# EAGLE design wireless_dip (EAGLE 4.16)
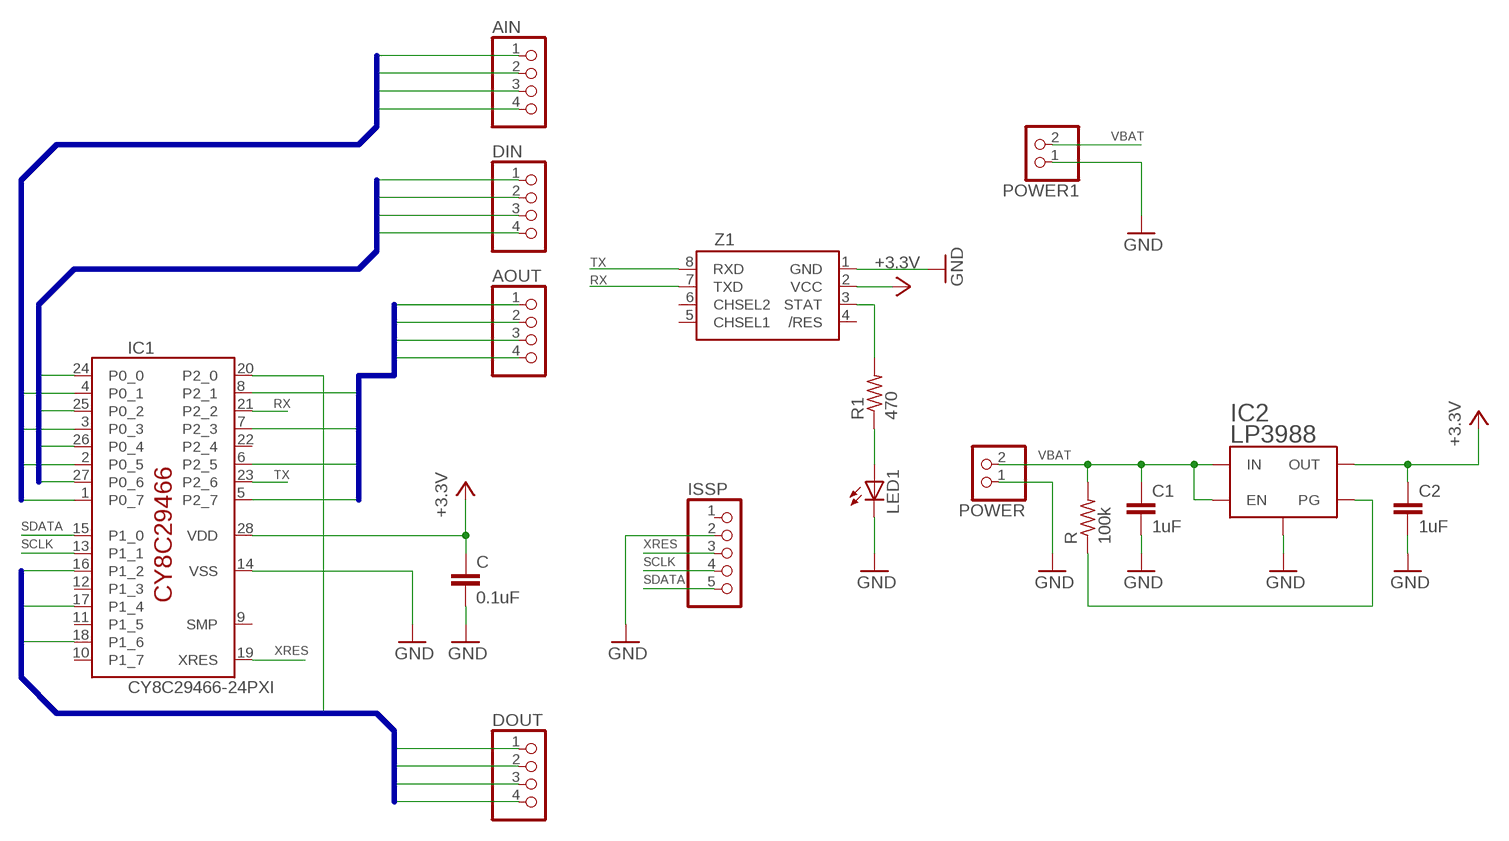
[diagram p0: schematic, sheet 1]

## Parts
AIN  PINHD-1X4  [1X04]
AOUT  PINHD-1X4  [1X04]
C  0.1uF  C-EUC1608  [C1608]
C1  1uF  C-EUC1608  [C1608]
C2  1uF  C-EUC1608  [C1608]
DIN  PINHD-1X4  [1X04]
DOUT  PINHD-1X4  [1X04]
IC1  CY8C29466-24PXI  [PDIP28]
IC2  LP3988  [SOT-23-5]
ISSP  PINHD-1X5  [1X05]
LED1  LEDCHIP-LED0603  [CHIP-LED0603]
POWER  PINHD-1X2  [1X02]
POWER1  PINHD-1X2  [1X02]
R  100k  R-US_R0603  [R0603]
R1  470  R-US_R0603  [R0603]
Z1  ZIG-100B  [ZIG-100B]

## Nets
+3V: C2.1 C.1 IC1.28(VDD) IC2.P$5(OUT) Z1.2(VCC) ; supply symbol labelled +3.3V
AIN0: AIN.1 IC1.1(P0_7)
AIN1: AIN.2 IC1.2(P0_5)
AIN2: AIN.3 IC1.3(P0_3)
AIN3: AIN.4 IC1.4(P0_1)
AOUT0: AOUT.1 IC1.5(P2_7)
AOUT1: AOUT.2 IC1.6(P2_5)
AOUT2: AOUT.3 IC1.7(P2_3)
AOUT3: AOUT.4 IC1.8(P2_1)
DIN0: DIN.1 IC1.27(P0_6)
DIN1: DIN.2 IC1.26(P0_4)
DIN2: DIN.3 IC1.25(P0_2)
DIN3: DIN.4 IC1.24(P0_0)
DOUT0: DOUT.1 IC1.20(P2_0)
DOUT1: DOUT.2 IC1.18(P1_6)
DOUT2: DOUT.3 IC1.17(P1_4)
DOUT3: DOUT.4 IC1.16(P1_2)
GND: C1.2 C2.2 C.2 IC1.14(VSS) IC2.P$2(GND) ISSP.2 LED1.C POWER1.1 POWER.1 Z1.1(GND)
N$1: R1.2 Z1.3(STAT)
N$2: LED1.A R1.1
PG: IC2.P$4(PG) R.1
RX: IC1.21(P2_2) Z1.7(TXD)
SCLK: IC1.13(P1_1) ISSP.4
SDATA: IC1.15(P1_0) ISSP.5
TX: IC1.23(P2_6) Z1.8(RXD)
VBAT: C1.1 IC2.P$1(IN) IC2.P$3(EN) POWER1.2 POWER.2 R.2
XRES: IC1.19(XRES) ISSP.3
Unconnected: IC1.9(SMP) IC1.10(P1_7) IC1.11(P1_5) IC1.12(P1_3) IC1.22(P2_4) ISSP.1 Z1.4(/RES) Z1.5(CHSEL1) Z1.6(CHSEL2)

## Buses
AIN[0..3]
AOUT[0..3]
DIN[0..3]
DOUT[0..3]

## Library data of the parts
AIN AOUT DIN DOUT = pinhead:PINHD-1X4: PIN HEADER
C C1 C2 = rcl:C-EU: CAPACITOR, European symbol
IC1 = cypress_psoc:CY8C29466-24*: PSoC Mixed-Signal Array CY8C29466-24PXI (DIP) CY8C29466-24SXI (SOIC) CY8C29466-24PVXI (SSOP)
IC2 = v-regulator_lp3988:LP3988
ISSP = pinhead:PINHD-1X5: PIN HEADER
LED1 = led:LED: LED OSRAM: - CHIPLED LG R971, LG N971, LY N971, LG Q971, LY Q971, LO R971, LY R971 LH N974, LH R974 LS Q976, LO Q976, LY Q976 LO Q996 - Hyper CHIPLED LW Q18S LB Q993, LB Q99A, LB R99A - SideLED LS A670, LO A670, LY A670, LG A670, LP A670 LB A673, LV A673, LT A673, LW A673 LH A674 LY A675 LS A676, LA A676, LO A676, LY A676, LW A676 LS A679, LY A679, LG A679 - Hyper Micro SIDELED® LS Y876, LA Y876, LO Y876, LY Y876 LT Y87S - SmartLED LW L88C, LW L88S LB L89C, LB L89S, LG L890 LS L89K, LO L89K, LY L89K LS L896, LA L896, LO L896, LY L896 - TOPLED LS T670, LO T670, LY T670, LG T670, LP T670 LSG T670, LSP T670, LSY T670, LOP T670, LYG T670 LG T671, LOG T671, LSG T671 LB T673, LV T673, LT T673, LW T673 LH T674 LS T676, LA T676, LO T676, LY T676, LB T676, LH T676, LSB T676, LW T676 LB T67C, LV T67C, LT T67C, LS T67K, LO T67K, LY T67K, LW E67C LS E67B, LA E67B, LO E67B, LY E67B, LB E67C, LV E67C, LT E67C LW T67C LS T679, LY T679, LG T679 LS T770, LO T770, LY T770, LG T770, LP T770 LB T773, LV T773, LT T773, LW T773 LH T774 LS E675, LA E675, LY E675, LS T675 LS T776, LA T776, LO T776, LY T776, LB T776 LHGB T686 LT T68C, LB T68C - Hyper Mini TOPLED® LB M676 - Mini TOPLED Santana® LG M470 LS M47K, LO M47K, LY M47K Source: http://www.osram.convergy.de - LUMILED® LXK2-PW12-R00, LXK2-PW12-S00, LXK2-PW14-U00, LXK2-PW14-V00 LXK2-PM12-R00, LXK2-PM12-S00, LXK2-PM14-U00 LXK2-PE12-Q00, LXK2-PE12-R00, LXK2-PE12-S00, LXK2-PE14-T00, LXK2-PE14-U00 LXK2-PB12-K00, LXK2-PB12-L00, LXK2-PB12-M00, LXK2-PB14-N00, LXK2-PB14-P00, LXK2-PB14-Q00 LXK2-PR12-L00, LXK2-PR12-M00, LXK2-PR14-Q00, LXK2-PR14-R00 LXK2-PD12-Q00, LXK2-PD12-R00, LXK2-PD12-S00 LXK2-PH12-R00, LXK2-PH12-S00 LXK2-PL12-P00, LXK2-PL12-Q00, LXK2-PL12-R00 Source: www.luxeon.com
POWER POWER1 = pinhead:PINHD-1X2: PIN HEADER
R R1 = rcl:R-US_: RESISTOR, American symbol
Z1 = besttechnology:ZIG-100B

## Board
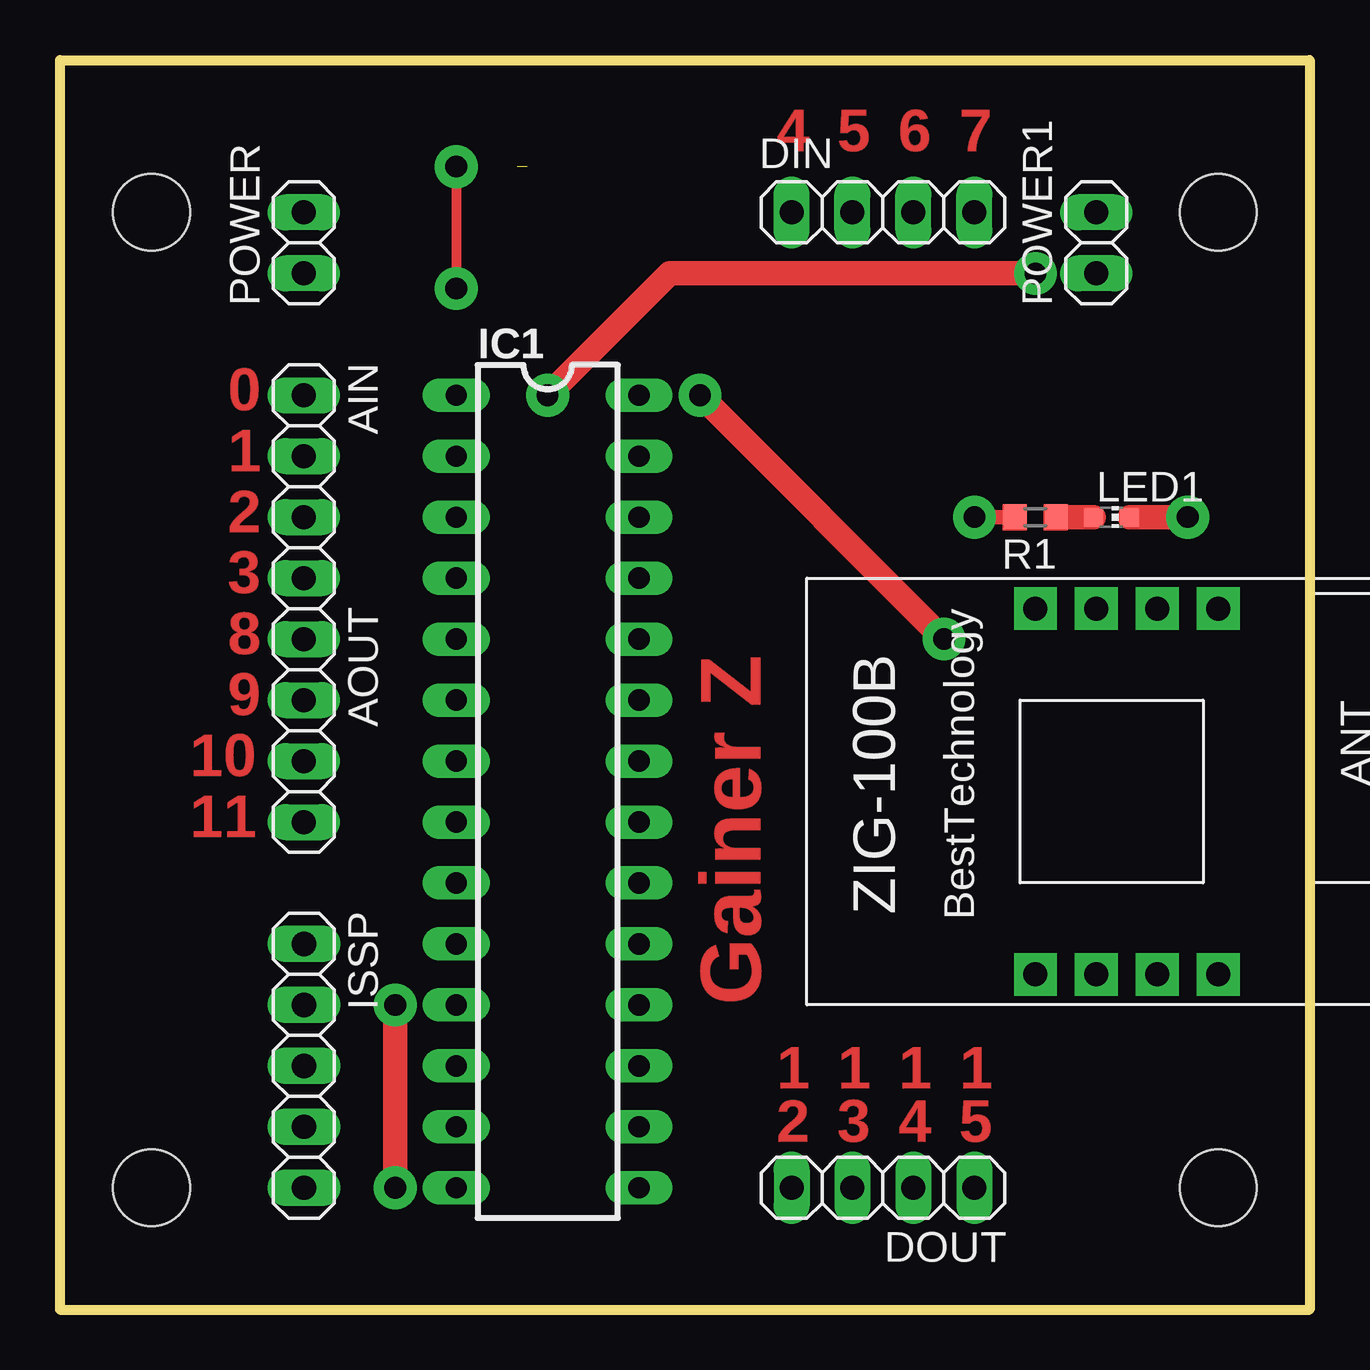
[diagram p1: board, top side]
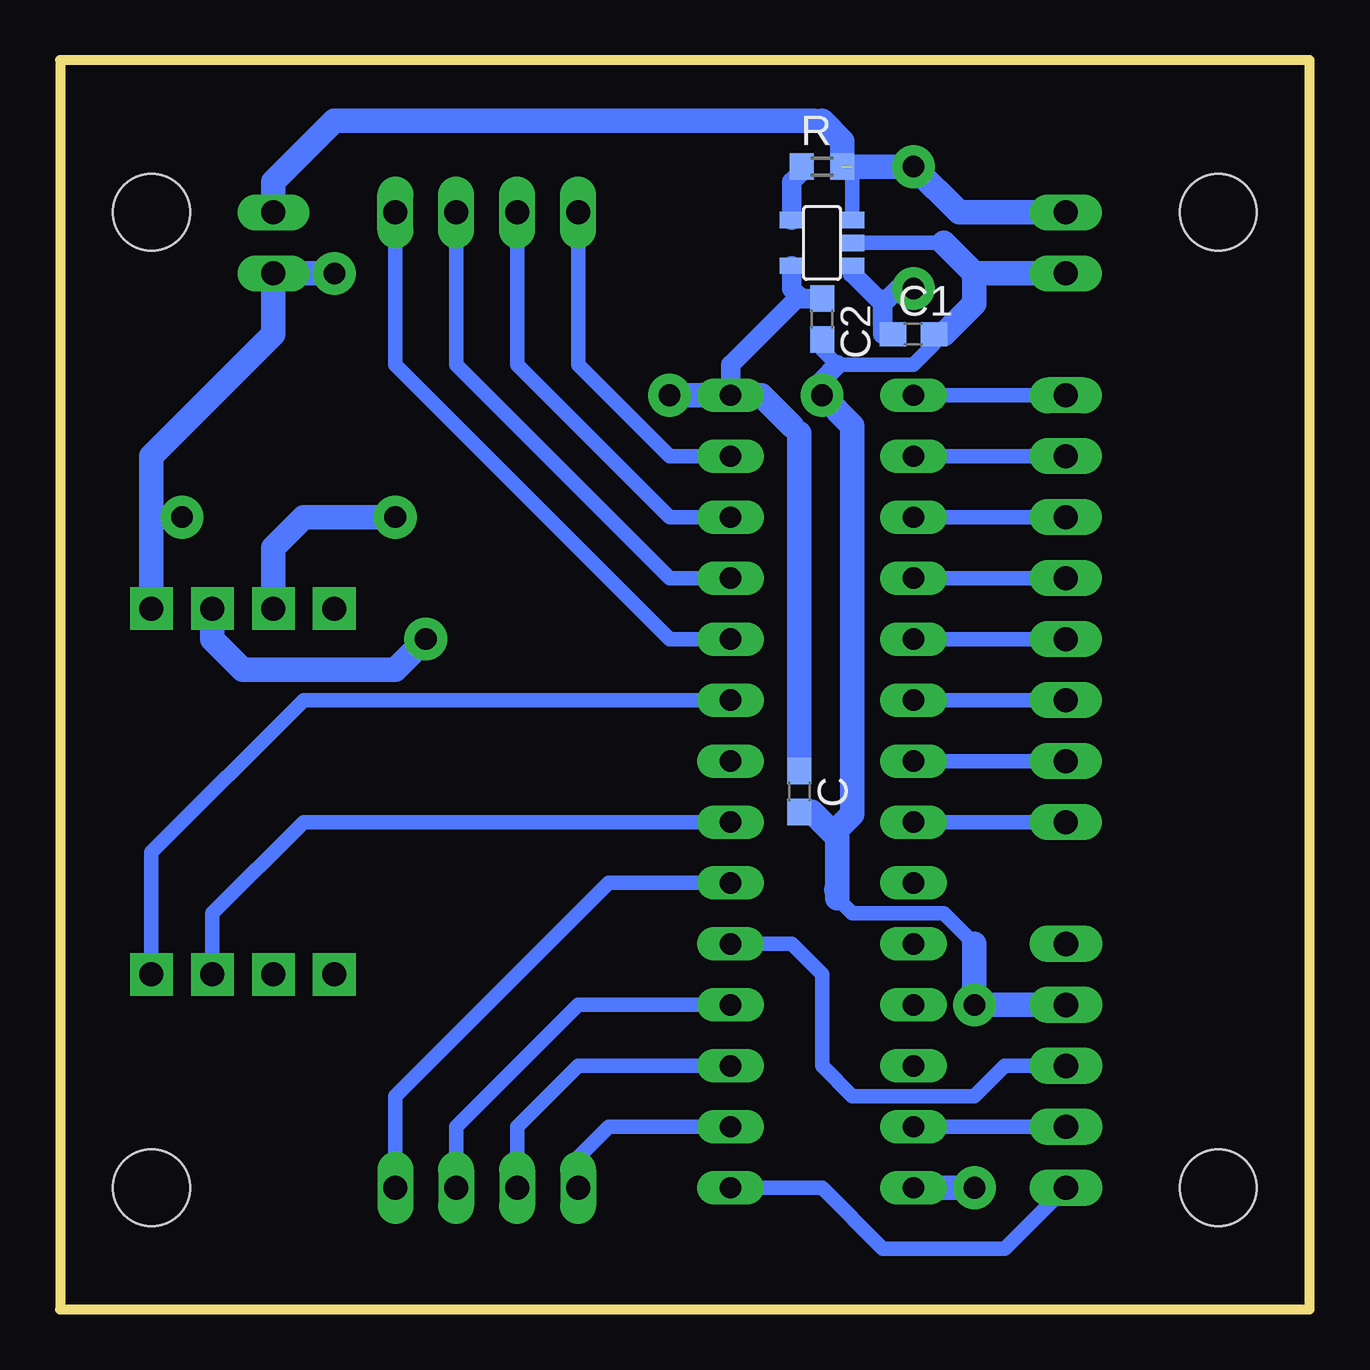
[diagram p2: board, bottom side, seen from below]

Size 52.07 x 52.07 mm. Coordinates in mm from the lower left corner, seen from the top.
Outline: 0,0 0,52.07 52.07,52.07 52.07,0 0,0
Copper layers (1*16): Top 0.035mm / dielectric 1.5mm / Bottom 0.035mm
Design rules "10mils": minimum track width 10mil, minimum drill 24mil, track to track 10mil, track to pad 10mil, pad to pad 10mil, via to via 10mil, smd to smd 10mil, copper to edge 40mil, drill to drill 10mil, minimum pad ring 10mil, minimum via ring 8mil, stop-mask expansion 0mil, vias tented up to drill 0mil, thermal gap 10mil
Holes 3.2 mm at 3.81,45.72 3.81,5.08 48.26,45.72 48.26,5.08

### Footprints (pad centres in the part's own frame; a part is rotated, then mirrored left to right if it is on the bottom)
1X04 = drill 1 long: 1 -3.81,0; 2 -1.27,0; 3 1.27,0; 4 3.81,0
C1608 = smd 1.1 x 1: 1 -0.85,0; 2 0.85,0
PDIP28 = drill 0.889 long: 1 -16.51,-3.81; 2 -13.97,-3.81; 3 -11.43,-3.81; 4 -8.89,-3.81; 5 -6.35,-3.81; 6 -3.81,-3.81; 7 -1.27,-3.81; 8 1.27,-3.81; 9 3.81,-3.81; 10 6.35,-3.81; 11 8.89,-3.81; 12 11.43,-3.81; 13 13.97,-3.81; 14 16.51,-3.81; 15 16.51,3.81; 16 13.97,3.81; 17 11.43,3.81; 18 8.89,3.81; 19 6.35,3.81; 20 3.81,3.81; 21 1.27,3.81; 22 -1.27,3.81; 23 -3.81,3.81; 24 -6.35,3.81; 25 -8.89,3.81; 26 -11.43,3.81; 27 -13.97,3.81; 28 -16.51,3.81
SOT-23-5 = smd 0.686 x 0.991: P$1 -0.953,-1.27; P$2 0,-1.27; P$3 0.953,-1.27; P$4 0.953,1.27; P$5 -0.953,1.27
1X05 = drill 1.016 long: 1 -5.08,0; 2 -2.54,0; 3 0,0; 4 2.54,0; 5 5.08,0
CHIP-LED0603 = smd 0.8 x 0.8: A 0,-0.75; C 0,0.75
1X02 = drill 1 long: 1 -1.27,0; 2 1.27,0
R0603 = smd 1 x 1.1: 1 -0.85,0; 2 0.85,0
ZIG-100B = drill 1 pad 1.778 square: 1 -7.62,3.81; 2 -7.62,1.27; 3 -7.62,-1.27; 4 -7.62,-3.81; 5 7.62,-3.81; 6 7.62,-1.27; 7 7.62,1.27; 8 7.62,3.81

### Placement (x,y rotation side)
AIN  10.16,34.29 270 top
AOUT  10.16,24.13 270 top
C  21.27,21.59 270 bottom
C1  16.51,40.64 0 bottom
C2  20.32,41.28 270 bottom
DIN  34.29,45.72 0 top
DOUT  34.29,5.08 180 top
IC1  20.32,21.59 270 top
IC2  20.32,44.45 90 bottom
ISSP  10.16,10.16 270 top
LED1  43.81,33.02 270 top
POWER  10.16,44.45 90 top
POWER1  43.18,44.45 90 top
R  20.32,47.62 0 bottom
R1  40.64,33.02 180 top
Z1  44.45,21.59 270 top

### Tracks (layer width: path | path; a pad name or v marks a point on that pad's centre or on a via)
+3V  (via drill 0.9 pad 1.78)
  Top 1.016: v26.67,38.1 v36.83,27.94
  Bottom 0.813: IC2.P$5 21.59,42.55 21.27,42.23 | IC1.28 24.13,39.37 21.27,42.23 | C2.1 21.17,42.12 21.27,42.23 | 21.27,36.51 21.59,36.83
  Bottom 1.016: v26.67,38.1 IC1.28 22.86,38.1 21.59,36.83 | Z1.2 45.72,27.94 44.45,26.67 38.1,26.67 v36.83,27.94 | C.1 21.27,36.51
AIN0
  Bottom 0.61: AIN.1 IC1.1
AIN1
  Bottom 0.61: AIN.2 IC1.2
AIN2
  Bottom 0.61: AIN.3 IC1.3
AIN3
  Bottom 0.61: AIN.4 IC1.4
AOUT0
  Bottom 0.61: AOUT.1 IC1.5
AOUT1
  Bottom 0.61: AOUT.2 IC1.6
AOUT2
  Bottom 0.61: AOUT.3 IC1.7
AOUT3
  Bottom 0.61: AOUT.4 IC1.8
DIN0
  Bottom 0.61: IC1.27 26.67,35.56 30.48,39.37 DIN.1
DIN1
  Bottom 0.61: IC1.26 26.67,33.02 33.02,39.37 DIN.2
DIN2
  Bottom 0.61: IC1.25 26.67,30.48 35.56,39.37 DIN.3
DIN3
  Bottom 0.61: IC1.24 26.67,27.94 38.1,39.37 DIN.4
DOUT0
  Bottom 0.61: IC1.20 29.21,17.78 38.1,8.89 DOUT.1
DOUT1
  Bottom 0.61: IC1.18 30.48,12.7 35.56,7.62 DOUT.2
DOUT2
  Bottom 0.61: IC1.17 30.48,10.16 33.02,7.62 DOUT.3
DOUT3
  Bottom 0.61: IC1.16 29.21,7.62 30.48,6.35 DOUT.4
GND  (via drill 0.9 pad 1.78)
  Top 1.016: v20.32,38.1 25.4,43.18 v40.64,43.18 | v46.99,33.02 LED1.C | v13.97,5.08 v13.97,12.7
  Bottom 0.61: 15.24,40.64 C1.2 15.66,40.22 16.51,39.37 19.68,39.37 20.32,40.01 C2.2 | 15.24,44.45 IC2.P$2 | 13.97,15.24 15.24,16.51 19.05,16.51 19.68,17.14
  Bottom 0.813: 19.68,39.37 20.32,38.74 v20.32,38.1 | 19.68,19.68 19.84,19.84 | 19.84,19.84
  Bottom 1.016: 13.97,43.18 POWER.1 | 13.97,43.18 15.24,44.45 | v40.64,43.18 POWER1.1 43.18,40.64 48.26,35.56 48.26,33.02 | v20.32,38.1 19.05,36.83 19.05,20.64 19.84,19.84 20.74,20.74 C.2 | 48.26,33.02 Z1.1 | 48.26,33.02 v46.99,33.02 | 13.97,43.18 13.97,41.91 15.24,40.64 | v13.97,5.08 IC1.14 | ISSP.2 v13.97,12.7 13.97,15.24 | 19.68,17.14 19.68,17.46 | 19.68,17.46 19.72,17.5 | 19.68,17.46 19.68,19.68
N$1  (via drill 0.9 pad 1.78)
  Top 0.61: R1.2 v38.1,33.02
  Bottom 1.016: v38.1,33.02 41.91,33.02 43.18,31.75 Z1.3
N$2
  Top 1.016: LED1.A R1.1
PG
  Bottom 0.813: R.1 21.17,47.41 21.59,46.99 IC2.P$4
RX
  Bottom 0.61: IC1.21 41.91,20.32 45.72,16.51 Z1.7
SCLK
  Bottom 0.61: ISSP.4 IC1.13
SDATA
  Bottom 0.61: ISSP.5 12.7,2.54 17.78,2.54 20.32,5.08 IC1.15
TX
  Bottom 0.61: IC1.23 41.91,25.4 48.26,19.05 Z1.8
VBAT  (via drill 0.9 pad 1.78)  (1 unrouted)
  Top 0.406: v16.51,47.62 v16.51,42.55
  Bottom 0.61: 19.05,43.18 IC2.P$1 | 17.78,40.64 C1.1 | IC2.P$3 19.05,47.62 | 20.32,49.53 20.64,49.53
  Bottom 0.813: 17.78,41.91 19.05,43.18 | 17.78,41.91 17.78,40.64 | v16.51,42.55 17.14,42.55 17.78,41.91
  Bottom 1.016: POWER1.2 43.18,46.99 40.64,49.53 20.64,49.53 | POWER.2 14.61,45.72 v16.51,47.62 R.2 19.47,48.68 20.32,49.53
XRES
  Bottom 0.61: ISSP.3 12.7,10.16 13.97,8.89 19.05,8.89 20.32,10.16 20.32,13.97 21.59,15.24 IC1.19

### Text on the board
Top: 4 | 5 | 6 | 7 | 0 | 1 | 2 | 3 | 8 | 9 | 10 | 11 | Gainer Z | 1 | 1 | 1 | 1 | 2 | 3 | 4 | 5